# Altium schematic sheet revisi sistem.SchDoc
size A3
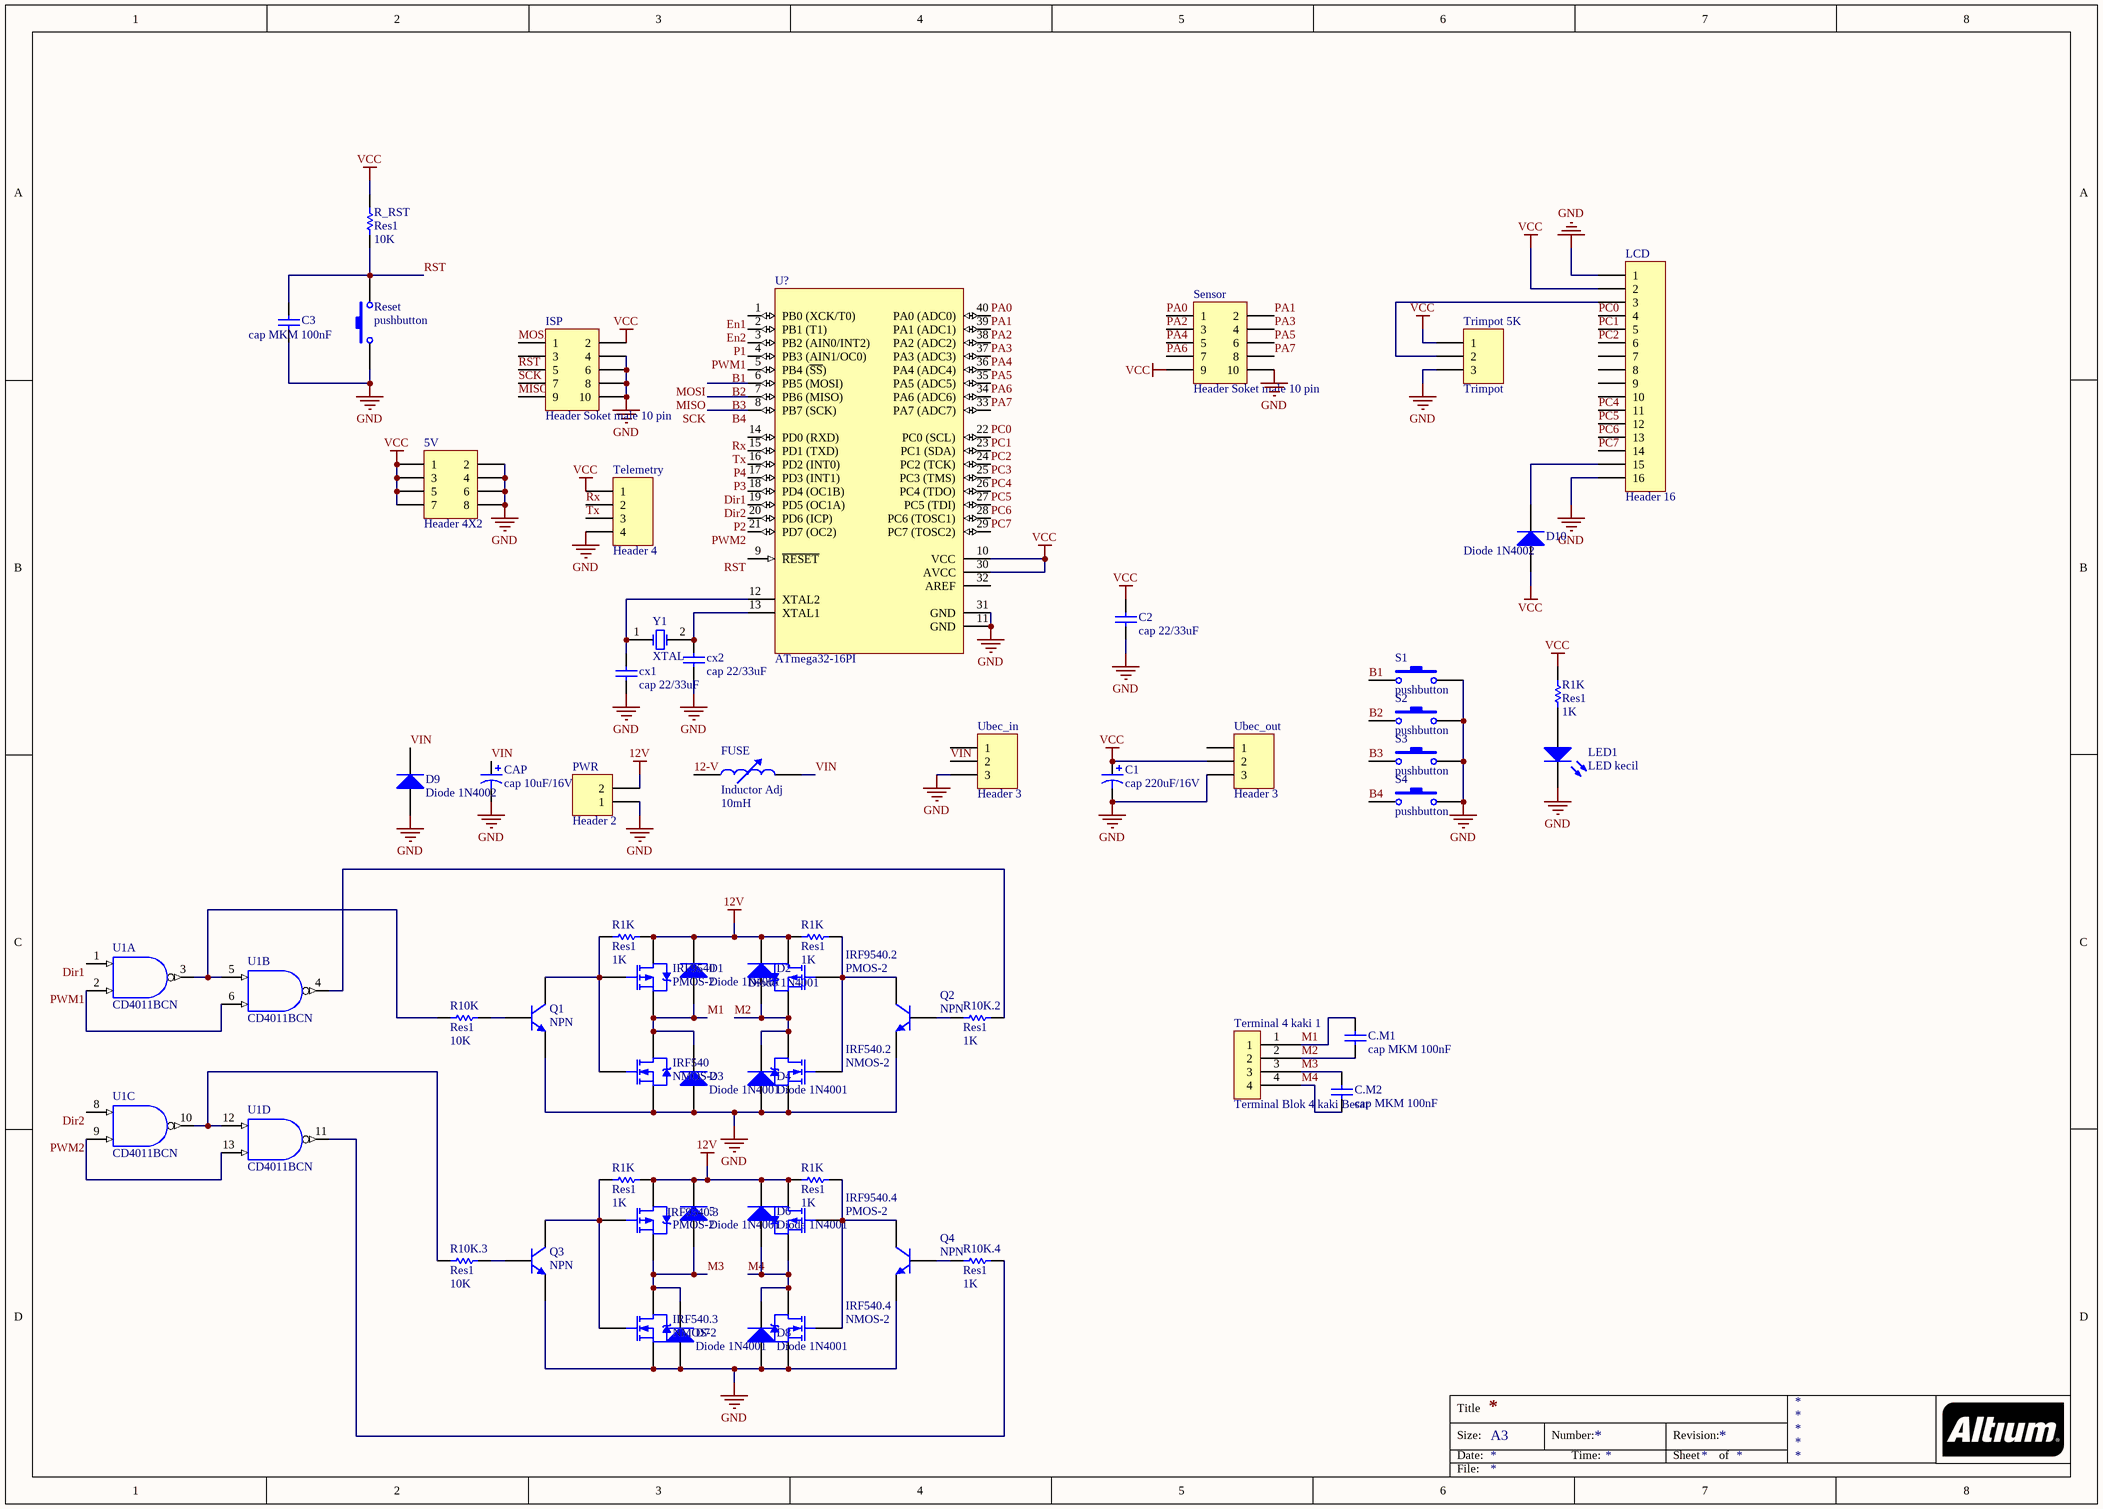
[diagram p0: revisi sistem.SchDoc]

## Parts
(Parts that share a designator on the sheet are numbered #1, #2 ... from top to bottom, then left to right.)
5  Diode 1N4001  [DIO10.46-5.3x2.8]
5V  Header 4X2  [HDR2X4]
C1  cap 220uF/16V  [cap 220uF/16V]
C2  cap 22/33uF  [cap 22/33uF]
C3  cap MKM 100nF  [cap MKM 100nF diri]
C.M1  cap MKM 100nF  [cap MKM 100nF diri]
C.M2  cap MKM 100nF  [cap MKM 100nF diri]
CAP  cap 10uF/16V  [cap 10uF/16V]
cx1  cap 22/33uF  [cap 22/33uF]
cx2  cap 22/33uF  [cap 22/33uF]
D1  Diode 1N4001  [DIO10.46-5.3x2.8]
D2  Diode 1N4001  [DIO10.46-5.3x2.8]
D3  Diode 1N4001  [DIO10.46-5.3x2.8]
D4  Diode 1N4001  [DIO10.46-5.3x2.8]
D6  Diode 1N4001  [DIO10.46-5.3x2.8]
D7  Diode 1N4001  [DIO10.46-5.3x2.8]
D8  Diode 1N4001  [DIO10.46-5.3x2.8]
D9  Diode 1N4002  [DIO10.46-5.3x2.8]
D10  Diode 1N4002  [DIO10.46-5.3x2.8]
FUSE  Inductor Adj  value 10mH  [AXIAL-0.8]
IRF540  NMOS-2  [SFM-T3/A4.7V]
IRF540.2  NMOS-2  [SFM-T3/A4.7V]
IRF540.3  NMOS-2  [SFM-T3/A4.7V]
IRF540.4  NMOS-2  [SFM-T3/A4.7V]
IRF9540  PMOS-2  [SFM-T3/A4.7V]
IRF9540.2  PMOS-2  [SFM-T3/A4.7V]
IRF9540.3  PMOS-2  [SFM-T3/A4.7V]
IRF9540.4  PMOS-2  [SFM-T3/A4.7V]
ISP  Header Soket male 10 pin  [Header Soket male 10 pin]
LCD  Header 16  [HDR1X16]
LED1  LED kecil  [LED kecil]
PWR  Header 2  [HDR1X2]
Q1  NPN  [BCY-W3]
Q2  NPN  [BCY-W3]
Q3  NPN  [BCY-W3]
Q4  NPN  [BCY-W3]
R1K#1  Res1  value 1K  [AXIAL-0.3]
R1K#2  Res1  value 1K  [AXIAL-0.3]
R1K#3  Res1  value 1K  [AXIAL-0.3]
R1K#4  Res1  value 1K  [AXIAL-0.3]
R1K#5  Res1  value 1K  [AXIAL-0.3]
R10K  Res1  value 10K  [AXIAL-0.3]
R10K.2  Res1  value 1K  [AXIAL-0.3]
R10K.3  Res1  value 10K  [AXIAL-0.3]
R10K.4  Res1  value 1K  [AXIAL-0.3]
R_RST  Res1  value 10K  [AXIAL-0.3]
Reset  pushbutton  [pushbutton]
S1  pushbutton  [pushbutton]
S2  pushbutton  [pushbutton]
S3  pushbutton  [pushbutton]
S4  pushbutton  [pushbutton]
Sensor  Header Soket male 10 pin  [Header Soket male 10 pin]
Telemetry  Header 4  [HDR1X4]
Terminal_4_kaki_1  Terminal Blok 4 kaki Besar  [TERMINAL 4 KAKI]
Trimpot_5K  Trimpot  [Trimpot Duduk]
U1  CD4011BCN  [N14A]  (parts A,B,C,D of 4)
U?  ATmega32-16PI  [40P6]
Ubec_in  Header 3  [HDR1X3]
Ubec_out  Header 3  [HDR1X3]
Y1  XTAL  [XTAL]

## Nets
12V: 5.2(K) D1.2(K) D2.2(K) D6.2(K) IRF9540.2(D) IRF9540.2.2(D) IRF9540.3.2(D) IRF9540.4.2(D) PWR.2 R1K#2.2 R1K#3.1 R1K#4.2 R1K#5.1
GND: 5V.2 5V.4 5V.6 5V.8 C1.2 C2.1 C3.1 CAP.2 cx1.1 cx2.1 D3.1(A) D4.1(A) D7.1(A) D8.1(A) D9.1(A) IRF540.3(S) IRF540.2.3(S) IRF540.3.3(S) IRF540.4.3(S) ISP.4 ISP.6 ISP.8 ISP.10 LCD.1 LCD.16 LED1.2(K) PWR.1 Q1.3(E) Q2.3(E) Q3.3(E) Q4.3(E) Reset.1 S1.2 S2.2 S3.2 S4.2 Sensor.10 Telemetry.4 Trimpot_5K.3 U1.7(GND) U?.11(GND) U?.31(GND) Ubec_in.3 Ubec_out.3
VCC: 5V.1 5V.3 5V.5 5V.7 C1.1 C2.2 D10.1(A) ISP.2 LCD.2 R1K#1.2 R_RST.2 Sensor.9 Telemetry.1 Trimpot_5K.1 U?.10(VCC) U?.30(AVCC) Ubec_out.2
VDD: U1.14(VDD)
12-V: FUSE.1
B1: S1.1 U?.5(PB4_(~{SS}))
B2: ISP.1 S2.1 U?.6(PB5_(MOSI))  [also labelled MOSI]
B3: ISP.9 S3.1 U?.7(PB6_(MISO))  [also labelled MISO]
B4: ISP.7 S4.1 U?.8(PB7_(SCK))  [also labelled SCK]
Dir1: U1.1(A) U?.18(PD4_(OC1B))
Dir2: U1.8(A) U?.19(PD5_(OC1A))
En1: U?.1(PB0_(XCK/T0))
En2: U?.2(PB1_(T1))
M1: C.M1.2 D1.1(A) D3.2(K) IRF540.2(D) IRF9540.3(S) Terminal_4_kaki_1.1
M2: C.M1.1 D2.1(A) D4.2(K) IRF540.2.2(D) IRF9540.2.3(S) Terminal_4_kaki_1.2
M3: 5.1(A) C.M2.2 D7.2(K) IRF540.3.2(D) IRF9540.3.3(S) Terminal_4_kaki_1.3
M4: C.M2.1 D6.1(A) D8.2(K) IRF540.4.2(D) IRF9540.4.3(S) Terminal_4_kaki_1.4
P1: U?.3(PB2_(AIN0/INT2))
P2: U?.20(PD6_(ICP))
P3: U?.17(PD3_(INT1))
P4: U?.16(PD2_(INT0))
PA0: Sensor.1 U?.40(PA0_(ADC0))
PA1: Sensor.2 U?.39(PA1_(ADC1))
PA2: Sensor.3 U?.38(PA2_(ADC2))
PA3: Sensor.4 U?.37(PA3_(ADC3))
PA4: Sensor.5 U?.36(PA4_(ADC4))
PA5: Sensor.6 U?.35(PA5_(ADC5))
PA6: Sensor.7 U?.34(PA6_(ADC6))
PA7: Sensor.8 U?.33(PA7_(ADC7))
PC0: LCD.4 U?.22(PC0_(SCL))
PC1: LCD.5 U?.23(PC1_(SDA))
PC2: LCD.6 U?.24(PC2_(TCK))
PC3: U?.25(PC3_(TMS))
PC4: LCD.11 U?.26(PC4_(TDO))
PC5: LCD.12 U?.27(PC5_(TDI))
PC6: LCD.13 U?.28(PC6_(TOSC1))
PC7: LCD.14 U?.29(PC7_(TOSC2))
PWM1: U1.2(B) U1.6(B) U?.4(PB3_(AIN1/OC0))
PWM2: U1.9(F) U1.13(B) U?.21(PD7_(OC2))
RST: C3.2 ISP.5 R_RST.1 Reset.2 U?.9(~{RESET})
Rx: Telemetry.2 U?.14(PD0_(RXD))
Tx: Telemetry.3 U?.15(PD1_(TXD))
VIN: CAP.1 D9.2(K) FUSE.2 Ubec_in.2
Netcx1_2: cx1.2 U?.12(XTAL2) Y1.1(OSC1)
Netcx2_2: cx2.2 U?.13(XTAL1) Y1.2(OSC2)
NetD10_2: D10.2(K) LCD.15
NetIRF540.2_1: IRF540.2.1(G) IRF9540.2.1(G) Q2.1(C) R1K#3.2
NetIRF540.3_1: IRF540.3.1(G) IRF9540.3.1(G) Q3.1(C) R1K#4.1
NetIRF540.4_1: IRF540.4.1(G) IRF9540.4.1(G) Q4.1(C) R1K#5.2
NetIRF540_1: IRF540.1(G) IRF9540.1(G) Q1.1(C) R1K#2.1
NetLCD_3: LCD.3 Trimpot_5K.2
NetLED1_1: LED1.1(A) R1K#1.1
NetQ1_2: Q1.2(B) R10K.2
NetQ2_2: Q2.2(B) R10K.2.1
NetQ3_2: Q3.2(B) R10K.3.2
NetQ4_2: Q4.2(B) R10K.4.1
NetR10K.2_2: R10K.2.2 U1.4(J)
NetR10K.3_1: R10K.3.1 U1.10(J) U1.12(A)
NetR10K.4_2: R10K.4.2 U1.11(J)
NetR10K_1: R10K.1 U1.3(J) U1.5(A)

Not connected (* = marked no-connect by the designer): ISP 3; LCD 7 8 9 10; U? 32(AREF); Ubec_in 1; Ubec_out 1

## Notes on the sheet
- Title
- Size:
- Date:
- A3
- Number:
- Time:
- Revision:
- Sheet
- of
- File:

## Library data of the parts
5 D1-D4 D6-D8 = Diode 1N4001: 1 Amp General Purpose Rectifier; Published: 8-Jun-2000; LatestRevisionDate: 17-Jul-2002; LatestRevisionNote: Re-released for DXP Platform.; DatasheetVersion: 1998; PackageVersion: Aug-1999; PackageReference: DO-41; Publisher: Altium Limited; Code_JEDEC: DO-204-AL; ComponentLink1Description: Manufacturer Link; ComponentLink1URL: http://www.fairchildsemi.com/; ComponentLink2Description: Datasheet; ComponentLink2URL: http://www.fairchildsemi.com/ds/1N%2F1N4001.pdf
5V = Header 4X2: Header, 4-Pin, Dual row; LatestRevisionDate: 17-Jul-2002; LatestRevisionNote: Re-released for DXP Platform.; Publisher: Altium Limited
D9 D10 = Diode 1N4002: 1 Amp General Purpose Rectifier; Published: 8-Jun-2000; LatestRevisionDate: 17-Jul-2002; LatestRevisionNote: Re-released for DXP Platform.; DatasheetVersion: 1998; PackageVersion: Aug-1999; PackageReference: DO-41; Publisher: Altium Limited; Code_JEDEC: DO-204-AL; ComponentLink1Description: Manufacturer Link; ComponentLink1URL: http://www.fairchildsemi.com/; ComponentLink2Description: Datasheet; ComponentLink2URL: http://www.fairchildsemi.com/ds/1N%2F1N4001.pdf
FUSE = Inductor Adj: Adjustable Inductor; Set Position: 0.5; Published: 24-Mar-1999; LatestRevisionDate: 17-Jul-2002; LatestRevisionNote: Re-released for DXP Platform.; PackageReference: AXIAL-0.8; Publisher: Altium Limited
IRF540 IRF540.2-IRF540.4 = NMOS-2: N-Channel Power MOSFET; Note: Pin 2 is electrically connected to pin 4.; Published: 8-Jun-2000; LatestRevisionDate: 17-Jul-2002; LatestRevisionNote: Re-released for DXP Platform.; DatasheetVersion: PD-9.814; PackageReference: TO-220AB; Publisher: Altium Limited; Code_JEDEC: TO-220-AB; ComponentLink1Description: Manufacturer Link; ComponentLink1URL: http://www.irf.com/
IRF9540 IRF9540.2-IRF9540.4 = PMOS-2: P-Channel Power MOSFET; Note: Pin 4 not drawn and electrically connected to Pin 2.; Published: 8-Jun-2000; LatestRevisionDate: 17-Jul-2002; LatestRevisionNote: Re-released for DXP Platform.; DatasheetVersion: PD-9.390D; PackageReference: TO-220AB; Publisher: Altium Limited; Code_JEDEC: TO-220-AB; ComponentLink1Description: Manufacturer Link; ComponentLink1URL: http://www.irf.com/
LCD = Header 16: Header, 16-Pin; LatestRevisionDate: 17-Jul-2002; LatestRevisionNote: Re-released for DXP Platform.; Publisher: Altium Limited
PWR = Header 2: Header, 2-Pin; LatestRevisionDate: 17-Jul-2002; LatestRevisionNote: Re-released for DXP Platform.; Publisher: Altium Limited
Q1-Q4 = NPN: NPN Bipolar Transistor; Published: 8-Jun-2000; LatestRevisionDate: 17-Jul-2002; LatestRevisionNote: Re-released for DXP Platform.; PackageReference: TO-226; Publisher: Altium Limited; Code_JEDEC: TO-226-AA
R1K#1-R1K#5 R10K R10K.2-R10K.4 R_RST = Res1: Resistor; Published: 8-Jun-2000; LatestRevisionDate: 17-Jul-2002; LatestRevisionNote: Re-released for DXP Platform.; PackageReference: AXIAL-0.3; Publisher: Altium Limited
Telemetry = Header 4: Header, 4-Pin; LatestRevisionDate: 17-Jul-2002; LatestRevisionNote: Re-released for DXP Platform.; Publisher: Altium Limited
Terminal_4_kaki_1 = Terminal Blok 4 kaki
Trimpot_5K = Trimpot Duduk
U1 = CD4011BCN: Quad 2-Input NAND Buffered B series Gate, 14-Pin PDIP; IC_Technology: C; Published: 17-Jul-2002; LatestRevisionDate: 29-May-2009; LatestRevisionNote: Component Body Added.; DatasheetVersion: Jan-1999; PackageVersion: 2000; PackageReference: N14A; Publisher: Altium Limited; PackageDescription: DIP, 14-Pin, Row Spacing 7.62 mm, Pitch 2.54 mm; ComponentLink1Description: Manufacturer Link; ComponentLink1URL: http://www.fairchildsemi.com/; ComponentLink2Description: Datasheet; ComponentLink2URL: http://www.fairchildsemi.com/ds/CD%2FCD4001BC.pdf
U? = ATmega32-16PI: 8-Bit AVR Microcontroller with 32K Bytes of In-System Programmable Flash Memory; Published: 17-Sep-2003; DatasheetVersion: 2503C-AVR-10/02; PackageVersion: revB, Sep-2001; PackageReference: 40P6; Publisher: Altium Limited; PackageDescription: 40-lead (0.600"/15.24mm Wide) Plastic Dual Inline Package (PDIP); Supplier 1: Digi-Key; Supplier Part Number 1: ATMEGA32-16PI-ND; Supplier 2: Farnell; Supplier Part Number 2: 4376328; Supplier 3: Mouser; Supplier Part Number 3: 556-ATMEGA32-16PI; Code_JEDEC: MS-011-AC; ComponentLink1Description: Datasheet; ComponentLink1URL: http://www.atmel.com/dyn/resources/prod_documents/doc2503.pdf; ComponentLink2Description: Atmel.com Home; ComponentLink2URL: http://www.atmel.com
Ubec_in Ubec_out = Header 3: Header, 3-Pin; LatestRevisionDate: 17-Jul-2002; LatestRevisionNote: Re-released for DXP Platform.; Publisher: Altium Limited